# EasyEDA schematic GNS530_shematic.json
TITLE: GNS530; REV: 1.0; Date: 2021-02-02; Sheet: 1/1; Drawn By: krok; Company: MIT licence
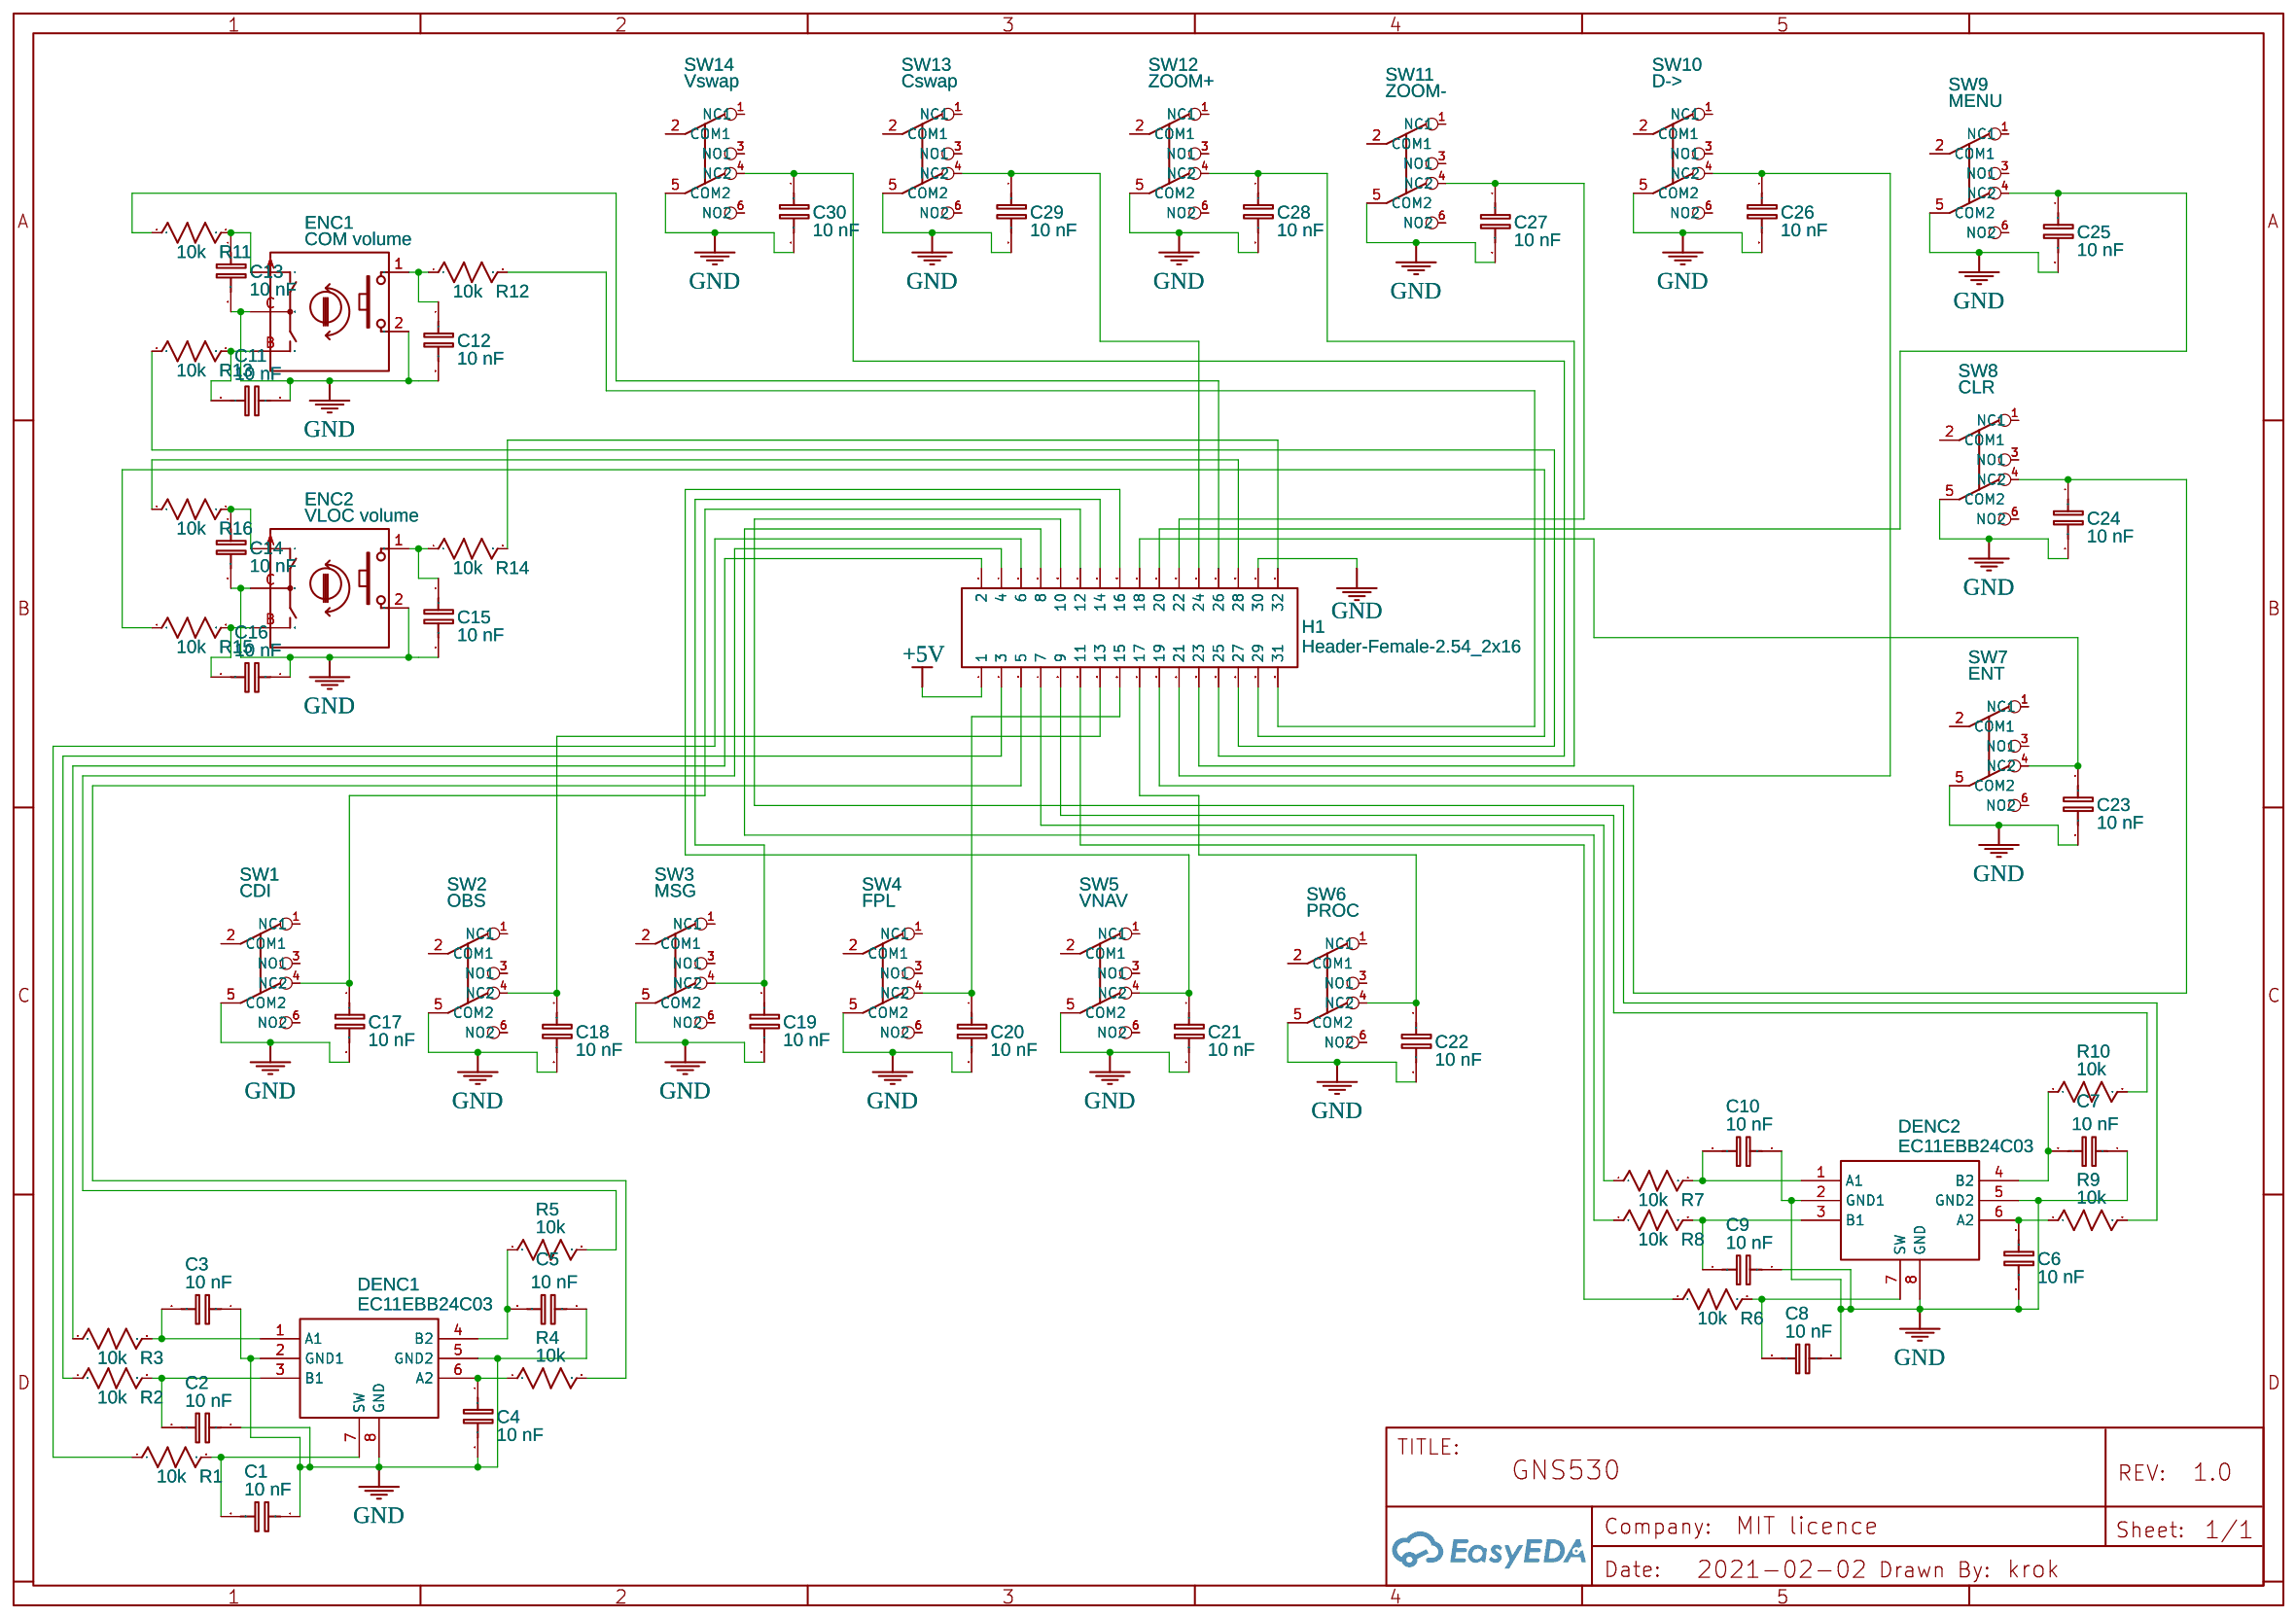
[diagram p0: schematic sheet]

## Parts
C1  10 nF  [RAD-0.1]
C2  10 nF  [RAD-0.1]
C3  10 nF  [RAD-0.1]
C4  10 nF  [RAD-0.1]
C5  10 nF  [RAD-0.1]
C6  10 nF  [RAD-0.1]
C7  10 nF  [RAD-0.1]
C8  10 nF  [RAD-0.1]
C9  10 nF  [RAD-0.1]
C10  10 nF  [RAD-0.1]
C11  10 nF  [RAD-0.1]
C12  10 nF  [RAD-0.1]
C13  10 nF  [RAD-0.1]
C14  10 nF  [RAD-0.1]
C15  10 nF  [RAD-0.1]
C16  10 nF  [RAD-0.1]
C17  10 nF  [RAD-0.1]
C18  10 nF  [RAD-0.1]
C19  10 nF  [RAD-0.1]
C20  10 nF  [RAD-0.1]
C21  10 nF  [RAD-0.1]
C22  10 nF  [RAD-0.1]
C23  10 nF  [RAD-0.1]
C24  10 nF  [RAD-0.1]
C25  10 nF  [RAD-0.1]
C26  10 nF  [RAD-0.1]
C27  10 nF  [RAD-0.1]
C28  10 nF  [RAD-0.1]
C29  10 nF  [RAD-0.1]
C30  10 nF  [RAD-0.1]
DENC1  EC11EBB24C03  [DUAL ENCODER W/CLICK]
DENC2  EC11EBB24C03  [DUAL ENCODER W/CLICK]
ENC1  COM volume  [ENCODER EC11]
ENC2  VLOC volume  [ENCODER EC11]
H1  Header-Female-2.54_2x16  [HDR-TH_32P-P2.54-V-M-R2-C16-S2.54]
R1  10k  [RESISTANCE]
R2  10k  [RESISTANCE]
R3  10k  [RESISTANCE]
R4  10k  [RESISTANCE]
R5  10k  [RESISTANCE]
R6  10k  [RESISTANCE]
R7  10k  [RESISTANCE]
R8  10k  [RESISTANCE]
R9  10k  [RESISTANCE]
R10  10k  [RESISTANCE]
R11  10k  [RESISTANCE]
R12  10k  [RESISTANCE]
R13  10k  [RESISTANCE]
R14  10k  [RESISTANCE]
R15  10k  [RESISTANCE]
R16  10k  [RESISTANCE]
SW1  CDI  [SW_PUSH_BUTTON_MINI_7X7MM]
SW2  OBS  [SW_PUSH_BUTTON_MINI_7X7MM]
SW3  MSG  [SW_PUSH_BUTTON_MINI_7X7MM]
SW4  FPL  [SW_PUSH_BUTTON_MINI_7X7MM]
SW5  VNAV  [SW_PUSH_BUTTON_MINI_7X7MM]
SW6  PROC  [SW_PUSH_BUTTON_MINI_7X7MM]
SW7  ENT  [SW_PUSH_BUTTON_MINI_7X7MM]
SW8  CLR  [SW_PUSH_BUTTON_MINI_7X7MM]
SW9  MENU  [SW_PUSH_BUTTON_MINI_7X7MM]
SW10  D->  [SW_PUSH_BUTTON_MINI_7X7MM]
SW11  ZOOM-  [SW_PUSH_BUTTON_MINI_7X7MM]
SW12  ZOOM+  [SW_PUSH_BUTTON_MINI_7X7MM]
SW13  Cswap  [SW_PUSH_BUTTON_MINI_7X7MM]
SW14  Vswap  [SW_PUSH_BUTTON_MINI_7X7MM]

## Library data of the parts
C1-C30 = Capacitor1_EU: Contributor: EasyEDA; Capacitance: 1u; sim: true
DENC1 DENC2 = EC11EBB24C03: Contributor: dotsha747; link: https://www.alps.com/prod/info/E/HTML/Encoder/Incremental/EC11/EC11EBB24C03.html
ENC1 ENC2 = Encoder EC11: Contributor: AlexP_Sar
H1 = Header-Female-2.54_2x16: Supplier: LCSC; Manufacturer: BOOMELE; Manufacturer Part: 2.54mm,2×16Double female header; image: //image.lceda.cn/szlcsc/C24778.jpg; Supplier Part: C24778; LCSC Assembly: Yes; SMT Type: Extend
R1-R16 = R_0201_US: Contributor: LCEDA_Lib; Package Display: No
SW1-SW14 = SW_PUSH_DPDT: Contributor: DangerousPrototype

## Nets
+5V: H1.1
GND: C1.1 C2.1 C3.1 C4.2 C5.1 C6.2 C7.1 C8.1 C9.1 C10.1 C11.1 C12.2 C13.2 C14.2 C15.2 C16.1 C17.2 C18.2 C19.2 C20.2 C21.2 C22.2 C23.2 C24.2 C25.2 C26.2 C27.2 C28.2 C29.2 C30.2 DENC1.2(GND1) DENC1.5(GND2) DENC1.8(GND) DENC2.2(GND1) DENC2.5(GND2) DENC2.8(GND) ENC1.2 ENC1.C ENC2.2 ENC2.C H1.30 SW1.5(COM2) SW2.5(COM2) SW3.5(COM2) SW4.5(COM2) SW5.5(COM2) SW6.5(COM2) SW7.5(COM2) SW8.5(COM2) SW9.5(COM2) SW10.5(COM2) SW11.5(COM2) SW12.5(COM2) SW13.5(COM2) SW14.5(COM2)
Net-(C1-2): C1.2 DENC1.7(SW) R1.2
Net-(C2-2): C2.2 DENC1.3(B1) R2.2
Net-(C3-2): C3.2 DENC1.1(A1) R3.2
Net-(C4-1): C4.1 DENC1.6(A2) R4.1
Net-(C5-2): C5.2 DENC1.4(B2) R5.1
Net-(C6-1): C6.1 DENC2.6(A2) R9.1
Net-(C7-2): C7.2 DENC2.4(B2) R10.1
Net-(C8-2): C8.2 DENC2.7(SW) R6.2
Net-(C9-2): C9.2 DENC2.3(B1) R8.2
Net-(C10-2): C10.2 DENC2.1(A1) R7.2
Net-(C11-2): C11.2 ENC1.B R13.2
Net-(C12-1): C12.1 ENC1.1 R12.1
Net-(C13-1): C13.1 ENC1.A R11.2
Net-(C14-1): C14.1 ENC2.A R16.2
Net-(C15-1): C15.1 ENC2.1 R14.1
Net-(C16-2): C16.2 ENC2.B R15.2
Net-(C17-1): C17.1 H1.12 SW1.4(NC2)
Net-(C18-1): C18.1 H1.13 SW2.4(NC2)
Net-(C19-1): C19.1 H1.14 SW3.4(NC2)
Net-(C20-1): C20.1 H1.15 SW4.4(NC2)
Net-(C21-1): C21.1 H1.16 SW5.4(NC2)
Net-(C22-1): C22.1 H1.17 SW6.4(NC2)
Net-(C23-1): C23.1 H1.18 SW7.4(NC2)
Net-(C24-1): C24.1 H1.19 SW8.4(NC2)
Net-(C25-1): C25.1 H1.20 SW9.4(NC2)
Net-(C26-1): C26.1 H1.21 SW10.4(NC2)
Net-(C27-1): C27.1 H1.22 SW11.4(NC2)
Net-(C28-1): C28.1 H1.23 SW12.4(NC2)
Net-(C29-1): C29.1 H1.24 SW13.4(NC2)
Net-(C30-1): C30.1 H1.25 SW14.4(NC2)
Net-(H1-2): H1.2 R3.1
Net-(H1-3): H1.3 R2.1
Net-(H1-4): H1.4 R5.2
Net-(H1-5): H1.5 R4.2
Net-(H1-6): H1.6 R1.1
Net-(H1-7): H1.7 R7.1
Net-(H1-8): H1.8 R8.1
Net-(H1-9): H1.9 R10.2
Net-(H1-10): H1.10 R9.2
Net-(H1-11): H1.11 R6.1
Net-(H1-26): H1.26 R11.1
Net-(H1-27): H1.27 R13.1
Net-(H1-28): H1.28 R16.1
Net-(H1-29): H1.29 R15.1
Net-(H1-31): H1.31 R12.2
Net-(H1-32): H1.32 R14.2

Not connected (* = marked no-connect by the designer): SW1 1(NC1) 2(COM1) 3(NO1) 6(NO2); SW2 1(NC1) 2(COM1) 3(NO1) 6(NO2); SW3 1(NC1) 2(COM1) 3(NO1) 6(NO2); SW4 1(NC1) 2(COM1) 3(NO1) 6(NO2); SW5 1(NC1) 2(COM1) 3(NO1) 6(NO2); SW6 1(NC1) 2(COM1) 3(NO1) 6(NO2); SW7 1(NC1) 2(COM1) 3(NO1) 6(NO2); SW8 1(NC1) 2(COM1) 3(NO1) 6(NO2); SW9 1(NC1) 2(COM1) 3(NO1) 6(NO2); SW10 1(NC1) 2(COM1) 3(NO1) 6(NO2); SW11 1(NC1) 2(COM1) 3(NO1) 6(NO2); SW12 1(NC1) 2(COM1) 3(NO1) 6(NO2); SW13 1(NC1) 2(COM1) 3(NO1) 6(NO2); SW14 1(NC1) 2(COM1) 3(NO1) 6(NO2)
